# EAGLE design THAT4305_Comp (EAGLE 9.6.2)
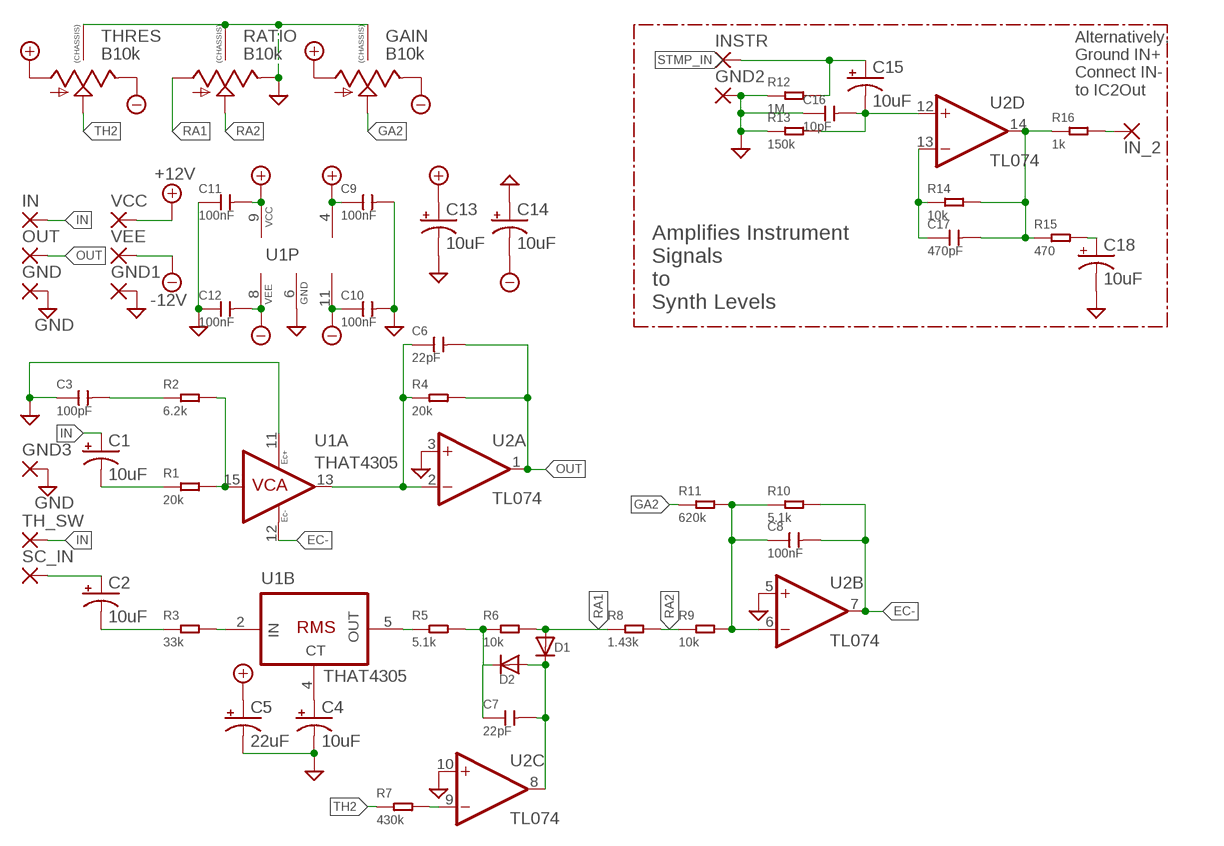
[diagram p0: schematic, sheet 1]

## Parts
C1  10uF  CAP_SMD+THRUPAN_B  [PAN_B_SMD+THRU]
C2  10uF  CAP_SMD+THRUPAN_B  [PAN_B_SMD+THRU]
C3  100pF  CERAMIC-1UF-25V-10%-X7R(0805)  [C0805]
C4  10uF  CAP_SMD+THRUPAN_B  [PAN_B_SMD+THRU]
C5  22uF  CAP_SMD+THRUPAN_B  [PAN_B_SMD+THRU]
C6  22pF  CERAMIC-1UF-25V-10%-X7R(0805)  [C0805]
C7  22pF  CERAMIC-1UF-25V-10%-X7R(0805)  [C0805]
C8  100nF  CERAMIC-1UF-25V-10%-X7R(0805)  [C0805]
C9  100nF  CERAMIC-1UF-25V-10%-X7R(0805)  [C0805]
C10  100nF  CERAMIC-1UF-25V-10%-X7R(0805)  [C0805]
C11  100nF  CERAMIC-1UF-25V-10%-X7R(0805)  [C0805]
C12  100nF  CERAMIC-1UF-25V-10%-X7R(0805)  [C0805]
C13  10uF  CAP_SMD+THRUPAN_B  [PAN_B_SMD+THRU]
C14  10uF  CAP_SMD+THRUPAN_B  [PAN_B_SMD+THRU]
C15  10uF  CAP_SMD+THRUPAN_B  [PAN_B_SMD+THRU]
C16  10pF  CERAMIC-1UF-25V-10%-X7R(0805)  [C0805]
C17  470pF  CERAMIC-1UF-25V-10%-X7R(0805)  [C0805]
C18  10uF  CAP_SMD+THRUPAN_B  [PAN_B_SMD+THRU]
D1  DIODESOD-123  [SOD-123]
D2  DIODESOD-123  [SOD-123]
GAIN  B10k  9MM_SNAP-IN_POT_CHASSIS  [9MM_SNAP-IN_POT]
GND  WIREPAD1,6/0,9  [1,6/0,9]
GND1  WIREPAD1,6/0,9  [1,6/0,9]
GND2  WIREPAD1,6/0,9  [1,6/0,9]
GND3  WIREPAD1,6/0,9  [1,6/0,9]
IN  WIREPAD1,6/0,9  [1,6/0,9]
IN_2  WIREPAD1,6/0,9  [1,6/0,9]
INSTR  WIREPAD1,6/0,9  [1,6/0,9]
OUT  WIREPAD1,6/0,9  [1,6/0,9]
R1  20k  SMD-RES-20K-5%-1/8W(0805)  [R0805]
R2  6.2k  SMD-RES-20K-5%-1/8W(0805)  [R0805]
R3  33k  SMD-RES-20K-5%-1/8W(0805)  [R0805]
R4  20k  SMD-RES-20K-5%-1/8W(0805)  [R0805]
R5  5.1k  SMD-RES-20K-5%-1/8W(0805)  [R0805]
R6  10k  SMD-RES-20K-5%-1/8W(0805)  [R0805]
R7  430k  SMD-RES-20K-5%-1/8W(0805)  [R0805]
R8  1.43k  SMD-RES-20K-5%-1/8W(0805)  [R0805]
R9  10k  SMD-RES-20K-5%-1/8W(0805)  [R0805]
R10  5.1k  SMD-RES-20K-5%-1/8W(0805)  [R0805]
R11  620k  SMD-RES-20K-5%-1/8W(0805)  [R0805]
R12  1M  SMD-RES-20K-5%-1/8W(0805)  [R0805]
R13  150k  SMD-RES-20K-5%-1/8W(0805)  [R0805]
R14  10k  SMD-RES-20K-5%-1/8W(0805)  [R0805]
R15  470  SMD-RES-20K-5%-1/8W(0805)  [R0805]
R16  1k  SMD-RES-20K-5%-1/8W(0805)  [R0805]
RATIO  B10k  9MM_SNAP-IN_POT_CHASSIS  [9MM_SNAP-IN_POT]
SC_IN  WIREPAD1,6/0,9  [1,6/0,9]
TH_SW  WIREPAD1,6/0,9  [1,6/0,9]
THRES  B10k  9MM_SNAP-IN_POT_CHASSIS  [9MM_SNAP-IN_POT]
U1  THAT4305  THAT4305Q16-U  [QSOP16]
U2  TL074  TL074_SMD  [SO14]
VCC  WIREPAD1,6/0,9  [1,6/0,9]
VEE  WIREPAD1,6/0,9  [1,6/0,9]

## Nets
+12V: C5.+ C5.++(+) C9.1 C11.2 C13.+ C13.++(+) GAIN.1(A) THRES.1(A) U1.9(P:VCC) U2.4(P:V+) VCC.1(P)
-12V: C10.1 C12.2 C14.- C14.--(-) GAIN.3(E) THRES.3(E) U1.8(P:VEE) U2.11(P:V-) VEE.1(P)
EC-: C8.2 R10.2 U1.12(A:EC-) U2.7(B:OUT)
GA2: GAIN.2(S) R11.1
GND: C3.1 C4.- C4.--(-) C5.- C5.--(-) C9.2 C10.2 C11.1 C12.1 C13.- C13.--(-) C14.+ C14.++(+) C16.1 C18.- C18.--(-) GAIN.CHASSIS1 GAIN.CHASSIS2 GND1.1(P) GND2.1(P) GND3.1(P) GND.1(P) R12.1 R13.1 RATIO.3(E) RATIO.CHASSIS1 RATIO.CHASSIS2 THRES.CHASSIS1 THRES.CHASSIS2 U1.6(P:GND) U1.11(A:EC+) U2.3(A:+IN) U2.5(B:+IN) U2.10(C:+IN)
IN: C1.+ C1.++(+) IN.1(P) TH_SW.1(P)
N$1: C1.- C1.--(-) R1.1
N$2: C3.2 R2.1
N$3: R1.2 R2.2 U1.15(A:VCA_IN)
N$4: C2.- C2.--(-) R3.1
N$5: R3.2 U1.2(B:RMS_IN)
N$6: C2.+ C2.++(+) SC_IN.1(P)
N$7: C4.+ C4.++(+) U1.4(B:CT)
N$9: C6.1 R4.1 U1.13(A:VCA_OUT) U2.2(A:-IN)
N$10: R5.1 U1.5(B:RMS_OUT)
N$11: C7.1 D2.C R5.2 R6.1
N$12: C8.1 R9.2 R10.1 R11.2 U2.6(B:-IN)
N$13: C7.2 D1.C D2.A U2.8(C:OUT)
N$14: R7.2 U2.9(C:-IN)
N$15: C17.1 R14.1 U2.13(D:-IN)
N$16: C15.- C15.--(-) C16.2 R13.2 U2.12(D:+IN)
N$17: C17.2 R14.2 R15.1 R16.1 U2.14(D:OUT)
N$18: C18.+ C18.++(+) R15.2
N$19: IN_2.1(P) R16.2
OUT: C6.2 OUT.1(P) R4.2 U2.1(A:OUT)
RA1: D1.A R6.2 R8.1 RATIO.1(A)
RA2: R8.2 R9.1 RATIO.2(S)
STMP_IN: C15.+ C15.++(+) INSTR.1(P) R12.2
TH2: R7.1 THRES.2(S)

## Notes on the sheet
- Alternatively,
  Ground IN+
  Connect IN-
  to IC2Out
- Amplifies Instrument
  Signals
  to
  Synth Levels

## Library data of the parts
C1 C2 C4 C5 C13-C15 C18 = MusicThingModular:CAP_SMD+THRU
C3 C6-C12 C16 C17 = OPL_Capacitor:CERAMIC-1UF-25V-10%-X7R(0805): 302010179; MPN: CC0805KKX7R8BB105; VALUE: 1uf
D1 D2 = adafruit:DIODE: Diode SMADIODE - SMA Surface Mount Package 20V 1A Schottky Diode Digikey: 641-1014-6-ND DO-1N4148 - Through Hole Small Current Diode SOD-123 20V 1 A (.5mV Vf) Schottky Diode - Digikey: MBRX120TPMSCT-ND SOD-323 10V 570mA (.38mV Vf, 3ns) Schottky Diode - Digikey: ZLLS410CT-ND SOD-523 30V 30mA Schottky Diode (RB751S-40TE61) - Digikey: RB751S-40TE61CT-ND SOT23-R/W - SOT23 Package (R = Solder Paste/Reflow Ovens, W = Hand-Soldering) BAT54Film 40V 300mA - Digikey: 497-7162-1-ND
GAIN RATIO THRES = MusicThingModular:9MM_SNAP-IN_POT_CHASSIS: 9mm vertical snap-in pot, Alpha / Panasonic style, with a connection to the metal chassis for grounding
GND GND1-GND3 IN IN_2 INSTR OUT SC_IN TH_SW VCC VEE = wirepad:WIREPAD: Wire PAD connect wire on PCB
R1-R16 = OPL_Resistor:SMD-RES-20K-5%-1/8W(0805): 301012190; MPN: RC0805JR-071KL; VALUE: 1K
U1 = that-corp:THAT4305: Pre-trimmed Analog Engine® IC
U2 = MusicThingModular:TL074: Generic Quad Op Amp

## Board
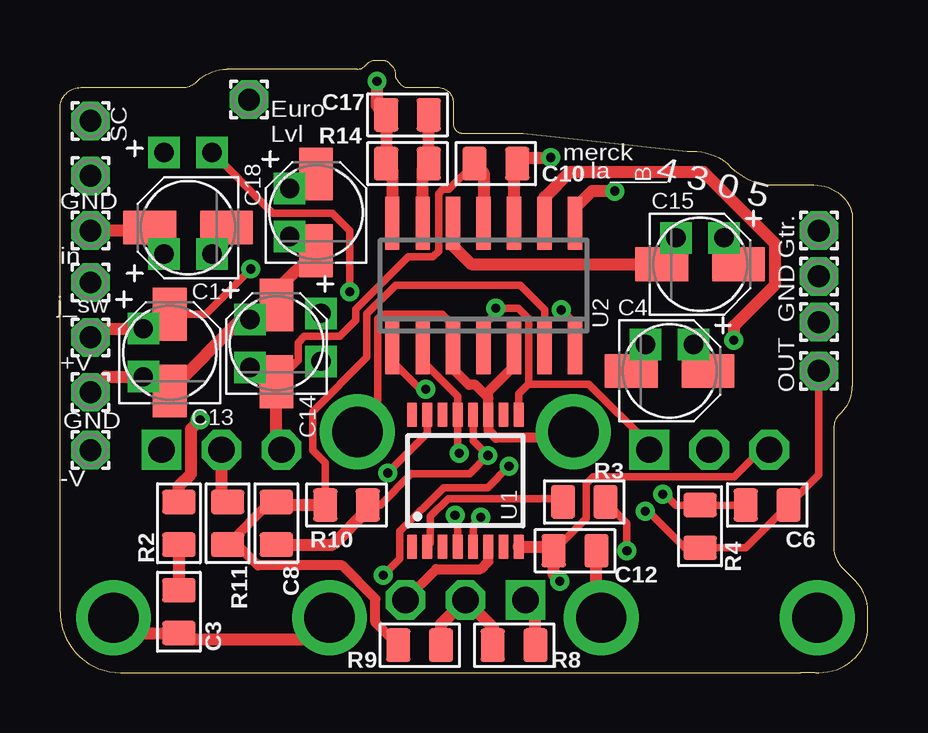
[diagram p1: board, top side]
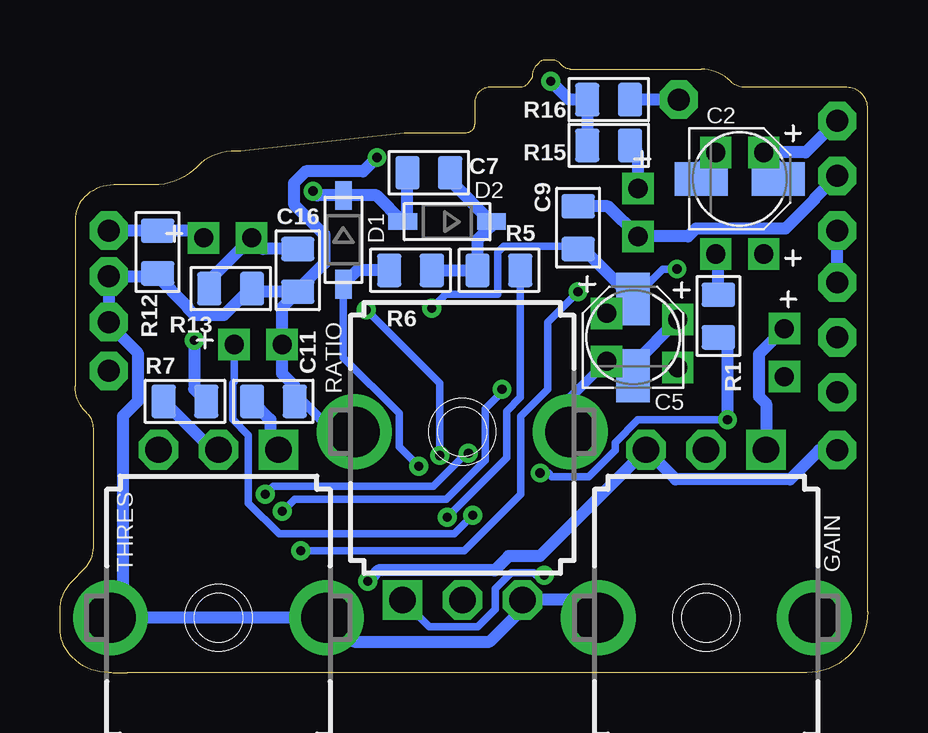
[diagram p2: board, bottom side, seen from below]

Size 33.66 x 25.53 mm. Coordinates in mm from the lower left corner, seen from the top.
Outline: 31.46,0 30.86,0 2.54,0 arc-90 0,2.54 0,23.52 arc-45 0.25,24.13 arc-45 0.87,24.38 5.1,24.38 arc45 5.71,24.64 arc-45 6.94,25.15 12.39,25.15 arc45 12.7,25.27 12.8,25.38 arc-45 13.16,25.53 13.41,25.53 arc-45 13.72,25.4 13.82,25.3 arc-45 13.97,24.94 13.97,24.89 arc45 14.06,24.68 14.07,24.66 arc45 14.43,24.38 15.75,24.38 arc-90 16.38,23.75 16.38,22.86 arc90 16.76,22.48 19.3,22.48 26.13,21.72 arc-45 27.8,21.23 27.96,21.06 arc45 29.75,20.32 31.41,20.32 arc-45 32.64,19.81 arc-45 33.02,18.89 33.02,11.94 arc-45 32.57,10.85 32.51,10.79 arc45 32.26,10.18 32.26,5.33 arc45 32.62,4.34 33.15,3.81 arc-45 33.66,2.58 33.66,1.86 arc-45 33.15,0.64 arc-45 31.61,0 31.5,0
Copper layers (1*16): Top 0.035mm / dielectric 1.5mm / Bottom 0.035mm
Design rules "default *": minimum track width 6mil, minimum drill 0.35mm, track to track 6mil, track to pad 6mil, pad to pad 6mil, via to via 6mil, smd to smd 6mil, copper to edge 15mil, drill to drill 6mil, minimum pad ring 10mil, minimum via ring 8mil, stop-mask expansion 4mil, vias tented up to drill 0mil, thermal gap 10mil

### Footprints (pad centres in the part's own frame; a part is rotated, then mirrored left to right if it is on the bottom)
PAN_B_SMD+THRU = smd 2.2 x 1.4: + 1.6,0; - -1.6,0 | drill 0.8 pad 0.9 square: ++ 1,1.1; -- -1,1.1
C0805 = smd 1.397 x 1.016: 1 0,0.889; 2 0,-0.889
SOD-123 = smd 1.2 x 0.7: A 1.85,0; C -1.85,0
9MM_SNAP-IN_POT = drill 1.1 square: 1 -2.5,-7 | drill 1.1 octagon: 2 0,-7; 3 2.5,-7 | drill 2.1 pad 2.794: CHASSIS1 -4.5,0; CHASSIS2 4.5,0
1,6/0,9 = drill 0.914 pad 1.6 octagon: 1 0,0
R0805 = smd 1.397 x 1.016: 1 0,0.889; 2 0,-0.889
QSOP16 = smd 0.4 x 1: 1 -2.223,-2.75; 2 -1.588,-2.75; 3 -0.953,-2.75; 4 -0.318,-2.75; 5 0.318,-2.75; 6 0.953,-2.75; 7 1.588,-2.75; 8 2.223,-2.75; 9 2.223,2.75; 10 1.588,2.75; 11 0.953,2.75; 12 0.318,2.75; 13 -0.318,2.75; 14 -0.953,2.75; 15 -1.588,2.75; 16 -2.223,2.75
SO14 = smd 0.6 x 2.2: 1 -3.81,-2.6; 2 -2.54,-2.6; 3 -1.27,-2.6; 4 0,-2.6; 5 1.27,-2.6; 6 2.54,-2.6; 7 3.81,-2.6; 8 3.81,2.6; 9 2.54,2.6; 10 1.27,2.6; 11 0,2.6; 12 -1.27,2.6; 13 -2.54,2.6; 14 -3.81,2.6

### Placement (x,y rotation side)
C1  5.33,18.54 180 top
C2  5.33,20.57 0 bottom
C3  4.95,2.54 180 top
C4  25.4,12.57 0 top
C5  9.78,13.97 90 bottom
C6  29.46,6.99 90 top
C7  18.29,20.83 270 bottom
C8  9.02,6.22 0 top
C9  12.06,18.54 180 bottom
C10  18.16,21.21 90 top
C11  24.77,11.3 270 bottom
C12  21.46,5.08 270 top
C13  4.57,13.34 90 top
C14  9.02,13.72 90 top
C15  26.67,17.02 0 top
C16  23.75,16.76 180 bottom
C17  14.48,23.24 270 top
C18  10.67,19.18 90 top
D1  21.84,18.03 270 bottom
D2  17.53,18.8 180 bottom
GAIN  6.73,2.29 180 bottom
GND  1.27,20.7 0 top
GND1  1.27,11.68 0 top
GND2  31.62,16.51 0 top
GND3  31.62,14.61 0 top
IN  1.27,16.26 0 top
IN_2  7.87,23.88 0 top
INSTR  31.62,18.41 0 top
OUT  31.62,12.57 0 top
R1  6.22,14.86 0 bottom
R2  4.95,6.22 180 top
R3  21.84,7.11 270 top
R4  26.67,6.1 0 top
R5  15.37,16.76 270 bottom
R6  19.05,16.76 270 bottom
R7  28.45,11.3 90 bottom
R8  18.92,1.14 270 top
R9  14.99,1.14 270 top
R10  11.94,6.99 90 top
R11  6.99,6.22 0 top
R12  29.59,17.53 180 bottom
R13  26.54,16 270 bottom
R14  14.48,21.21 270 top
R15  10.79,21.97 90 bottom
R16  10.79,23.88 90 bottom
RATIO  16.89,10.03 0 bottom
SC_IN  1.27,22.99 0 top
TH_SW  1.27,18.41 0 top
THRES  27.05,2.29 180 bottom
U1  16.89,8 0 top
U2  17.65,16.13 0 top
VCC  1.27,13.97 0 top
VEE  1.27,9.27 0 top

### Tracks (layer width: path | path; a pad name or v marks a point on that pad's centre or on a via)
+12V  (via drill 0.38)
  Top 0.305: U1.9 19.11,11.63 19.51,12.02 | 19.51,12.02 19.53,12.04 19.53,14.76 19.09,15.19 18.37,15.19 18.16,14.98 | U2.4 17.65,14.47 18.16,14.98 | 18.16,14.98 v18.16,15.19 | 19.51,12.02 22.04,12.02 24.55,9.51 THRES.1 | C13.+ 6.06,14.94 v7.95,16.82
  Top 0.508: VCC.1 1.64,14.34 C13.++ 4.07,14.94 C13.+
  Bottom 0.305: v18.16,15.19 17.59,15.76 15.42,15.76 15.42,17.51 15.16,17.77 12.65,17.77 12.53,17.65 C9.1 | v7.95,16.82 8.53,16.82 C5.+
  Bottom 0.508: THRES.1 24.89,9.63 24.89,10.54 C11.2 | GAIN.1 4.23,11.21 4.53,11.51 4.53,13.28 C13.++ | C5.++ 10.38,14.97 C5.+ 11.86,17.65 C9.1
-12V  (via drill 0.38)
  Top 0.305: C14.- 9.92,13.02 9.92,13.75 10.18,14.01 11.66,14.01 12.32,14.68 12.32,15.13 14.51,17.32 15.54,17.32 15.78,17.56 15.78,19.95 15.96,20.13 16.2,20.13 C10.1 | C12.2 21.92,6.43 21.92,7.86 22.21,8.16 28.09,8.16 29.23,9.29 THRES.3
  Top 0.508: C14.-- 8.52,12.12 C14.- 9.02,9.5 GAIN.3 | U2.11 17.65,20.83 C10.1 | U1.8 20.4,5.25 C12.2 20.57,4.08 20.83,3.82 v20.83,3.81
  Bottom 0.508: VEE.1 2.02,9.27 3.24,8.05 8,8.05 GAIN.3 13.66,4.85 14.96,4.85 15.55,4.26 20.38,4.26 20.62,4.03 20.62,4.02 v20.83,3.81
EC-  (via drill 0.38)
  Top 0.305: U2.7 21.46,14.54 v20.89,15.11 | U1.12 17.21,9.67 v17.83,9.05 17.07,8.29 14.64,8.29 13.34,6.99 R10.2
  Top 0.508: C8.2 11.36,5.33 12.83,6.8 R10.2
  Bottom 0.305: v20.89,15.11 17.83,12.05 v17.83,9.05
GA2
  Top 0.508: R11.1 6.73,7.37 GAIN.2
GND  (via drill 0.38)
  Top 0.305: U2.3 16.35,13.56 16.35,14.5 15.92,14.93 13.42,14.93 13.24,14.76 13.24,10.88 RATIO.CHASSIS2
  Top 0.406: 17.84,11.45 U1.11 17.84,10.1 18.16,9.78 21.14,9.78 RATIO.CHASSIS1 | 17.84,11.45 17.84,11.7 18.92,12.78 U2.5 | 17.84,11.45 17.3,11.99 17.04,11.99 16.38,12.64 U2.3 | C14.+ 8.42,14.72 C14.++ | RATIO.3 15.68,4.32 17.53,4.32 17.84,4.64 U1.6
  Top 0.508: GND1.1 1.92,12.34 C13.-- 3.97,12.34 C13.- 7.55,14.72 C14.++ | C4.- 24.4,13.17 C4.-- | C14.+ 9.02,15.93 C18.- 10.17,17.58 C18.-- | U2.10 18.92,21.08 C10.2 19.3,21.46 v20.45,21.46 | GAIN.CHASSIS1 2.41,2.29 3.05,1.65 C3.1 5.21,1.4 10.41,1.4 11.23,2.21 GAIN.CHASSIS2 | THRES.CHASSIS1 22.35,2.48 C12.1
  Bottom 0.406: C5.- 10.38,12.97 C5.-- 12.39,11.46 RATIO.CHASSIS2 | RATIO.CHASSIS1 22.28,10.03 23.55,11.3 C11.1
  Bottom 0.508: 29.65,16.57 29.72,16.51 GND2.1 GND3.1 31.62,14.53 30.42,13.33 30.42,11.3 31.04,10.69 31.04,2.8 THRES.CHASSIS2 THRES.CHASSIS1 22.39,2.29 21.4,1.29 15.75,1.29 14.39,2.65 RATIO.3 11.98,3.03 GAIN.CHASSIS2 | 29.65,16.57 R12.1 | C11.1 23.88,11.94 24.4,12.46 C4.-- 24.4,15.22 C16.1 | C16.1 25.53,15.88 R13.1 25.73,16 26.83,14.9 28.03,14.9 28.35,15.21 28.35,15.27 29.65,16.57 | C14.++ 9.78,12.85 C5.- | C9.2 10.82,19.43 C18.-- 7.48,18.18 7.16,18.5 3.43,18.5 2.23,19.71 2.23,19.74 GND.1 | v20.45,21.46 21.02,20.89 23.42,20.89 23.91,20.4 23.91,19.52 22.64,18.25 22.64,17.05 23.75,15.95 C16.1
IN
  Top 0.508: TH_SW.1 3.61,18.41 C1.+ 3.73,18.04 C1.++
  Bottom 0.508: IN.1 TH_SW.1
N$1
  Top 0.508: C1.-- 6.33,17.94 C1.-
  Bottom 0.508: R1.1 6.22,17.33 C1.--
N$2
  Top 0.508: R2.1 C3.2
N$3  (via drill 0.38)
  Top 0.305: v13.65,8.32 15.3,9.97 U1.15
  Top 0.508: v5.84,10.54 5.46,10.16 5.46,8.29 4.95,7.78 R2.2
  Bottom 0.305: v5.84,10.54 9.57,10.54 10.53,9.59 10.53,9.26 11.62,8.17 13.16,8.17 13.31,8.32 v13.65,8.32
  Bottom 0.508: v5.84,10.54 5.84,13.59 R1.2
N$4  (via drill 0.38)
  Top 0.305: v23.62,5.08 23.62,6.22 R3.1 | C2.-- 8.61,19.4 8.87,19.14 11.34,19.14 12.07,18.41 v12.07,15.87
  Bottom 0.305: v23.62,5.08 16.82,5.08 14.46,7.43 14.46,10.68 13.34,11.81 13.34,14.61 v12.07,15.87
  Bottom 0.508: C2.- 6.93,21.07 C2.--
N$5
  Top 0.305: U1.2 15.43,5.38 15.43,6.51 16.17,7.25 20.81,7.25 R3.2
N$6
  Bottom 0.508: SC_IN.1 2.58,21.67 C2.++ 3.73,21.07 C2.+
N$7  (via drill 0.38)
  Top 0.305: U1.4 16.57,6.38 16.46,6.49 v16.46,6.55
  Top 0.508: C4.++ 27,13.07 C4.+
  Bottom 0.305: v16.46,6.55 17.24,5.78 24.52,5.78 25.81,7.07 25.81,9.89 26.47,10.55 26.47,12.05 26.4,12.12 C4.++
N$9  (via drill 0.38)
  Top 0.305: U2.2 15.11,12.97 16.57,11.51 U1.13 16.57,9.21 v16.64,9.14 | v25.11,7.43 25.21,7.43 25.65,6.99 R4.1 C6.1
  Bottom 0.305: v25.11,7.43 24.76,7.78 18.09,7.78 16.73,9.14 v16.64,9.14
N$10  (via drill 0.38)
  Top 0.305: U1.5 17.21,6.16 v17.53,6.48
  Bottom 0.305: R5.1 14.48,11.47 15.05,10.9 15.05,8.95 v17.53,6.48
N$11
  Bottom 0.508: C7.1 17.4,20.52 D2.C 15.68,18.61 16.26,18.03 R5.2 R6.1
N$12
  Top 0.305: R10.1 11.05,8.74 10.53,9.26 10.53,10.88 12.78,13.13 12.78,14.95 13.98,16.14 19.17,16.14 20.19,15.12 U2.6
  Top 0.406: C8.1 8.76,7.11 R11.2 7.38,5.33 8.25,4.47 11.75,4.47 13.14,3.08 13.14,2.1 R9.2
  Top 0.508: R10.1 9.14,6.99 C8.1
N$13  (via drill 0.38)
  Top 0.508: v23.11,20.07 22.16,20.07 21.46,19.36 U2.8
  Bottom 0.508: C7.2 19.18,19 D2.A 20.46,19.88 D1.C 22.93,19.88 v23.11,20.07
N$14  (via drill 0.38)
  Top 0.508: U2.9 20.19,19.82 21.24,20.87 26.8,20.87 29.78,17.89 29.78,16.15 28.07,14.44 v28.07,13.84
  Bottom 0.508: v28.07,13.84 28.07,11.81 R7.2
N$15
  Top 0.508: U2.13 15.11,20.95 R14.1 C17.1
N$16
  Top 0.508: C15.-- 25.67,17.62 C15.- 17.14,17.02 16.38,17.77 U2.12
  Bottom 0.508: C16.2 25.2,17.65 C15.-- 27.43,16.36 R13.2
N$17  (via drill 0.38)
  Top 0.508: v13.21,24.64 13.21,23.62 C17.2 R14.2 13.84,20.95 U2.14
  Bottom 0.508: R15.1 R16.1 12.45,23.88 v13.21,24.64
N$18
  Top 0.508: C18.++ 10.07,20.18 C18.+
  Bottom 0.508: C18.++ 9.57,21.63 R15.2
N$19
  Bottom 0.508: IN_2.1 R16.2
OUT  (via drill 0.38)
  Top 0.305: v24.39,6.73 24.52,6.73 26.04,5.21 R4.2 28.57,5.21 C6.2 31.62,8.26 OUT.1 | U2.1 13.84,12.97 14.94,11.87 15.18,11.87 v15.24,11.81
  Bottom 0.305: v24.39,6.73 23.88,7.23 17.56,7.23 15.94,8.86 15.94,10.99 15.24,11.68 v15.24,11.81
RA1  (via drill 0.38)
  Top 0.305: v18.71,8.6 17.82,7.71 15.98,7.71 14.16,5.89 14.16,4.74 v13.47,4.05
  Top 0.508: R8.1 19.81,2.61 RATIO.1
  Bottom 0.305: v18.71,8.6 19.53,9.42 19.53,10.8 21.84,13.12 D1.A | v13.47,4.05 13.81,4.05 13.92,4.16 14.86,4.16 15.52,3.5 15.52,2.64 16.26,1.9 18.26,1.9 RATIO.1
  Bottom 0.508: R6.2 21.26,16.76 D1.A
RA2
  Top 0.508: R8.2 18.03,1.89 RATIO.2 15.88,2.02 R9.1
STMP_IN
  Top 0.508: C15.+ 27.67,17.62 C15.++
  Bottom 0.508: C15.++ 27.97,18.41 R12.2 INSTR.1
TH2
  Bottom 0.508: THRES.2 27.32,9.29 R7.1

### Text on the board
tPlace: SC | Euro / Lvl | merck | la____ | 4 3 0 5 | B | GND | in | Gtr. | j_sw | GND | +V | OUT | GND | -V